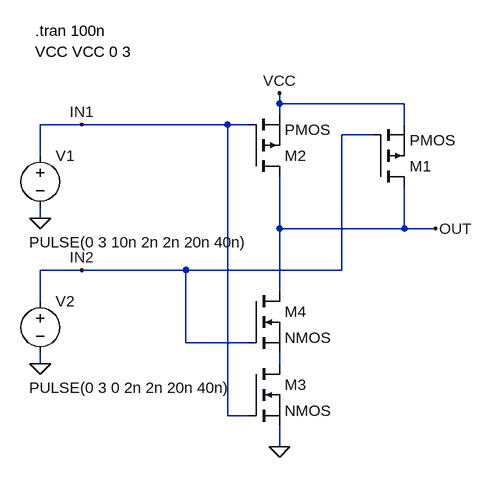
[diagram p0: schematic Fig_6-30_CMOS_NAND.asc]
Fig_6-30_CMOS_NAND.asc, the LTspice schematic file:
Version 4
SHEET 1 880 680
WIRE 192 -80 192 -96
WIRE 384 -80 192 -80
WIRE 192 -64 192 -80
WIRE -112 -48 -176 -48
WIRE 112 -48 -112 -48
WIRE 144 -48 112 -48
WIRE 384 -48 384 -80
WIRE 336 -32 288 -32
WIRE -176 0 -176 -48
WIRE -176 96 -176 80
WIRE 192 112 192 32
WIRE 384 112 384 48
WIRE 384 112 192 112
WIRE 432 112 384 112
WIRE -112 176 -176 176
WIRE 48 176 -112 176
WIRE 288 176 288 -32
WIRE 288 176 48 176
WIRE 192 208 192 112
WIRE -176 224 -176 176
WIRE 48 288 48 176
WIRE 144 288 48 288
WIRE -176 320 -176 304
WIRE 192 320 192 304
WIRE 112 400 112 -48
WIRE 144 400 112 400
WIRE 192 448 192 416
FLAG 192 448 0
FLAG 432 112 OUT
FLAG -112 -48 IN1
FLAG 192 -96 VCC
FLAG -176 96 0
FLAG -112 176 IN2
FLAG -176 320 0
SYMBOL pmos 144 32 M180
SYMATTR InstName M2
SYMBOL voltage -176 -16 R0
WINDOW 3 -17 149 Left 2
WINDOW 123 0 0 Left 2
WINDOW 39 0 0 Left 2
SYMATTR Value PULSE(0 3 10n 2n 2n 20n 40n)
SYMATTR InstName V1
SYMBOL nmos 144 320 R0
SYMATTR InstName M3
SYMBOL pmos 336 48 M180
SYMATTR InstName M1
SYMBOL voltage -176 208 R0
WINDOW 3 -17 149 Left 2
WINDOW 123 0 0 Left 2
WINDOW 39 0 0 Left 2
SYMATTR Value PULSE(0 3 0 2n 2n 20n 40n)
SYMATTR InstName V2
SYMBOL nmos 144 208 R0
SYMATTR InstName M4
TEXT -184 -160 Left 2 !VCC VCC 0 3
TEXT -184 -192 Left 2 !.tran 100n

The netlist it stands for:
* Fig_6-30_CMOS_NAND.asc
M2 OUT IN1 VCC VCC PMOS
V1 IN1 0 PULSE(0 3 10n 2n 2n 20n 40n)
M3 N001 IN1 0 0 NMOS
M1 OUT IN2 VCC VCC PMOS
V2 IN2 0 PULSE(0 3 0 2n 2n 20n 40n)
M4 OUT IN2 N001 N001 NMOS
.model NMOS NMOS
.model PMOS PMOS
.lib standard.mos
VCC VCC 0 3
.tran 100n
.backanno
.end